# EAGLE design CARTE_PUISSANCE (EAGLE 9.5.1)
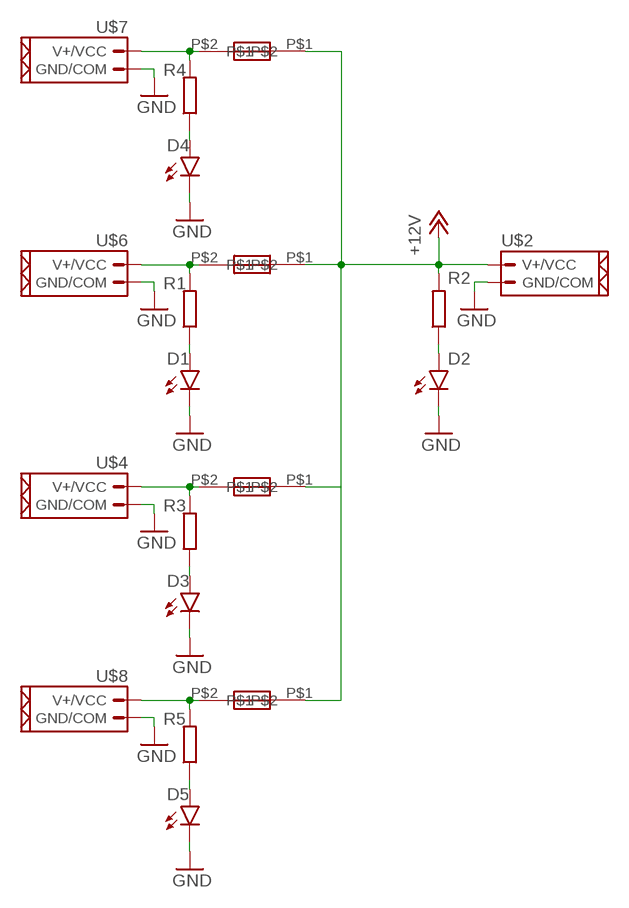
[diagram p0: schematic, sheet 1]

## Parts
D1  LED5MM  [LED_5MM]
D2  LED5MM  [LED_5MM]
D3  LED5MM  [LED_5MM]
D4  LED5MM  [LED_5MM]
D5  LED5MM  [LED_5MM]
R1  R-EU_0204/7  [0204/7]
R2  R-EU_0204/7  [0204/7]
R3  R-EU_0204/7  [0204/7]
R4  R-EU_0204/7  [0204/7]
R5  R-EU_0204/7  [0204/7]
U$1  AUTOMOTIVE_FUSE  [AUTOMOTIVE_FUSE]
U$2  CONN_02_PUIXT60  [XT60]
U$3  AUTOMOTIVE_FUSE  [AUTOMOTIVE_FUSE]
U$4  CONN_02_PUIXT60  [XT60]
U$5  AUTOMOTIVE_FUSE  [AUTOMOTIVE_FUSE]
U$6  CONN_02_PUIXT60  [XT60]
U$7  CONN_02_PUIXT60  [XT60]
U$8  CONN_02_PUIXT60  [XT60]
U$9  AUTOMOTIVE_FUSE  [AUTOMOTIVE_FUSE]

## Nets
+12V: R2.2 U$1.P$1 U$2.P$1(V+/VCC) U$3.P$1 U$5.P$1 U$9.P$1
GND: D1.K(C) D2.K(C) D3.K(C) D4.K(C) D5.K(C) U$2.P$2(GND/COM) U$4.P$2(GND/COM) U$6.P$2(GND/COM) U$7.P$2(GND/COM) U$8.P$2(GND/COM)
N$1: R1.2 U$3.P$2 U$6.P$1(V+/VCC)
N$2: D1.A R1.1
N$3: R5.2 U$8.P$1(V+/VCC) U$9.P$2
N$4: D2.A R2.1
N$5: R3.2 U$4.P$1(V+/VCC) U$5.P$2
N$6: D3.A R3.1
N$7: R4.2 U$1.P$2 U$7.P$1(V+/VCC)
N$8: D4.A R4.1
N$9: D5.A R5.1

## Library data of the parts
D1-D5 = OPENBOT:LED: LED (Generic) Standard schematic elements and footprints for 5mm, 3mm, 1206, and 0603 sized LEDs. Generic LEDs with no color specified.
R1-R5 = rcl:R-EU_: RESISTOR, European symbol; SPICEPREFIX: R
U$1 U$3 U$5 U$9 = OPENBOT:AUTOMOTIVE_FUSE
U$2 U$4 U$6-U$8 = OPENBOT:CONN_02_PUI

## Board
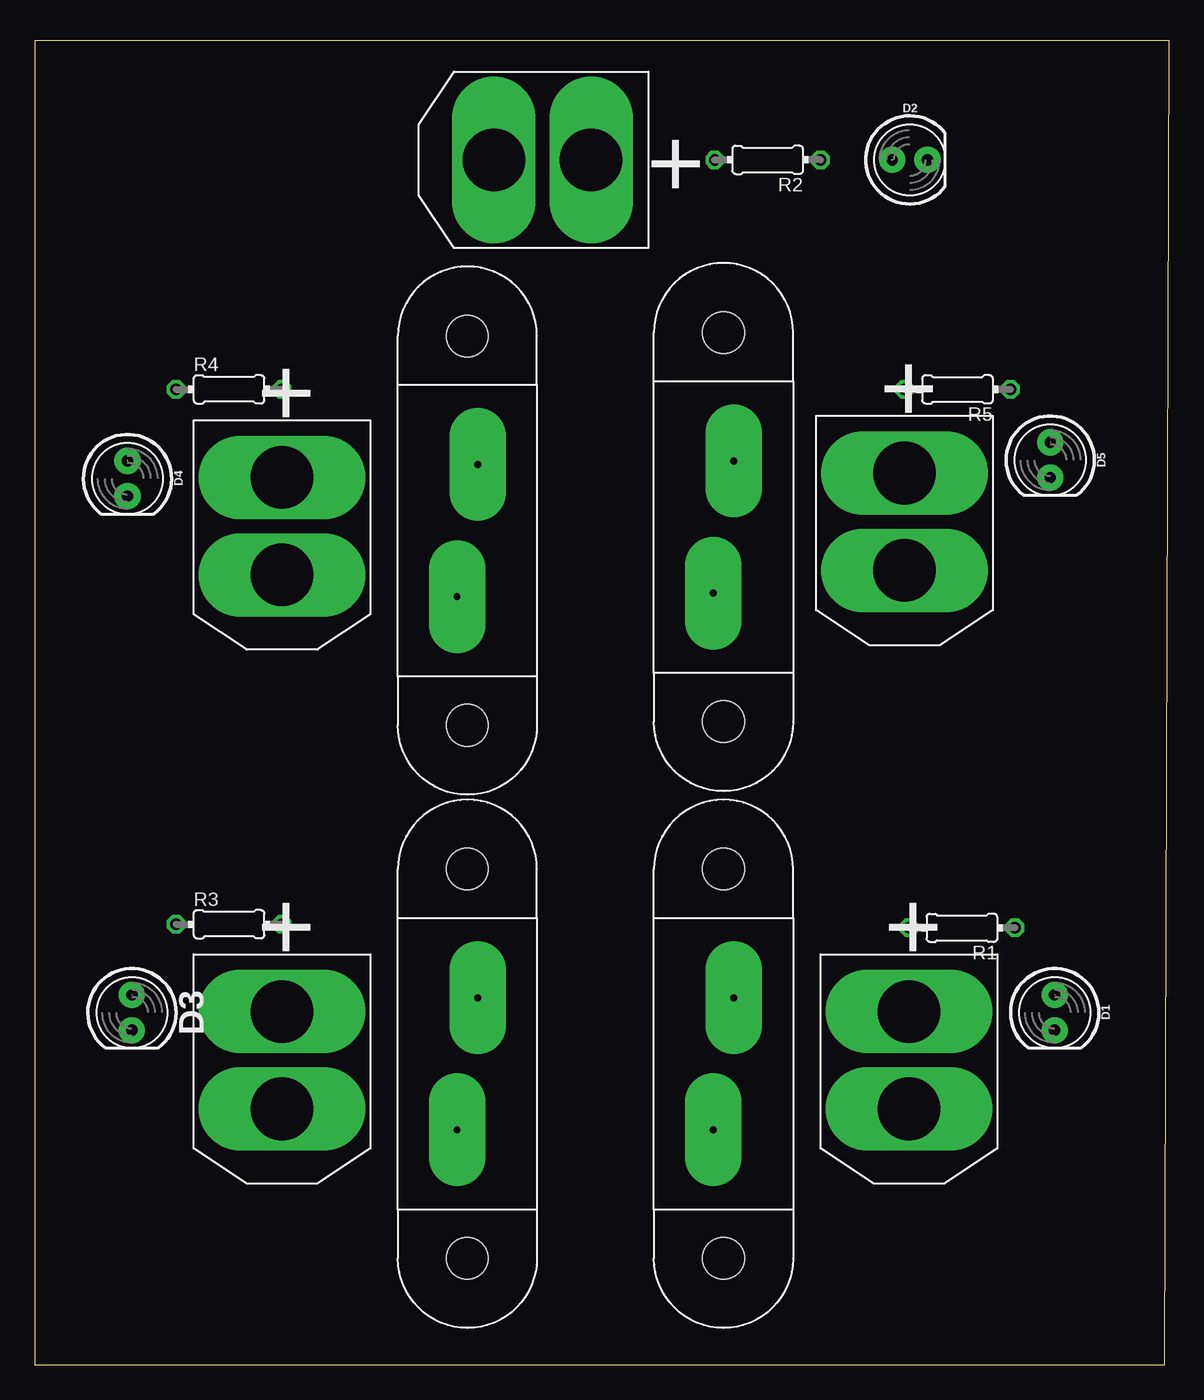
[diagram p1: board, top side]
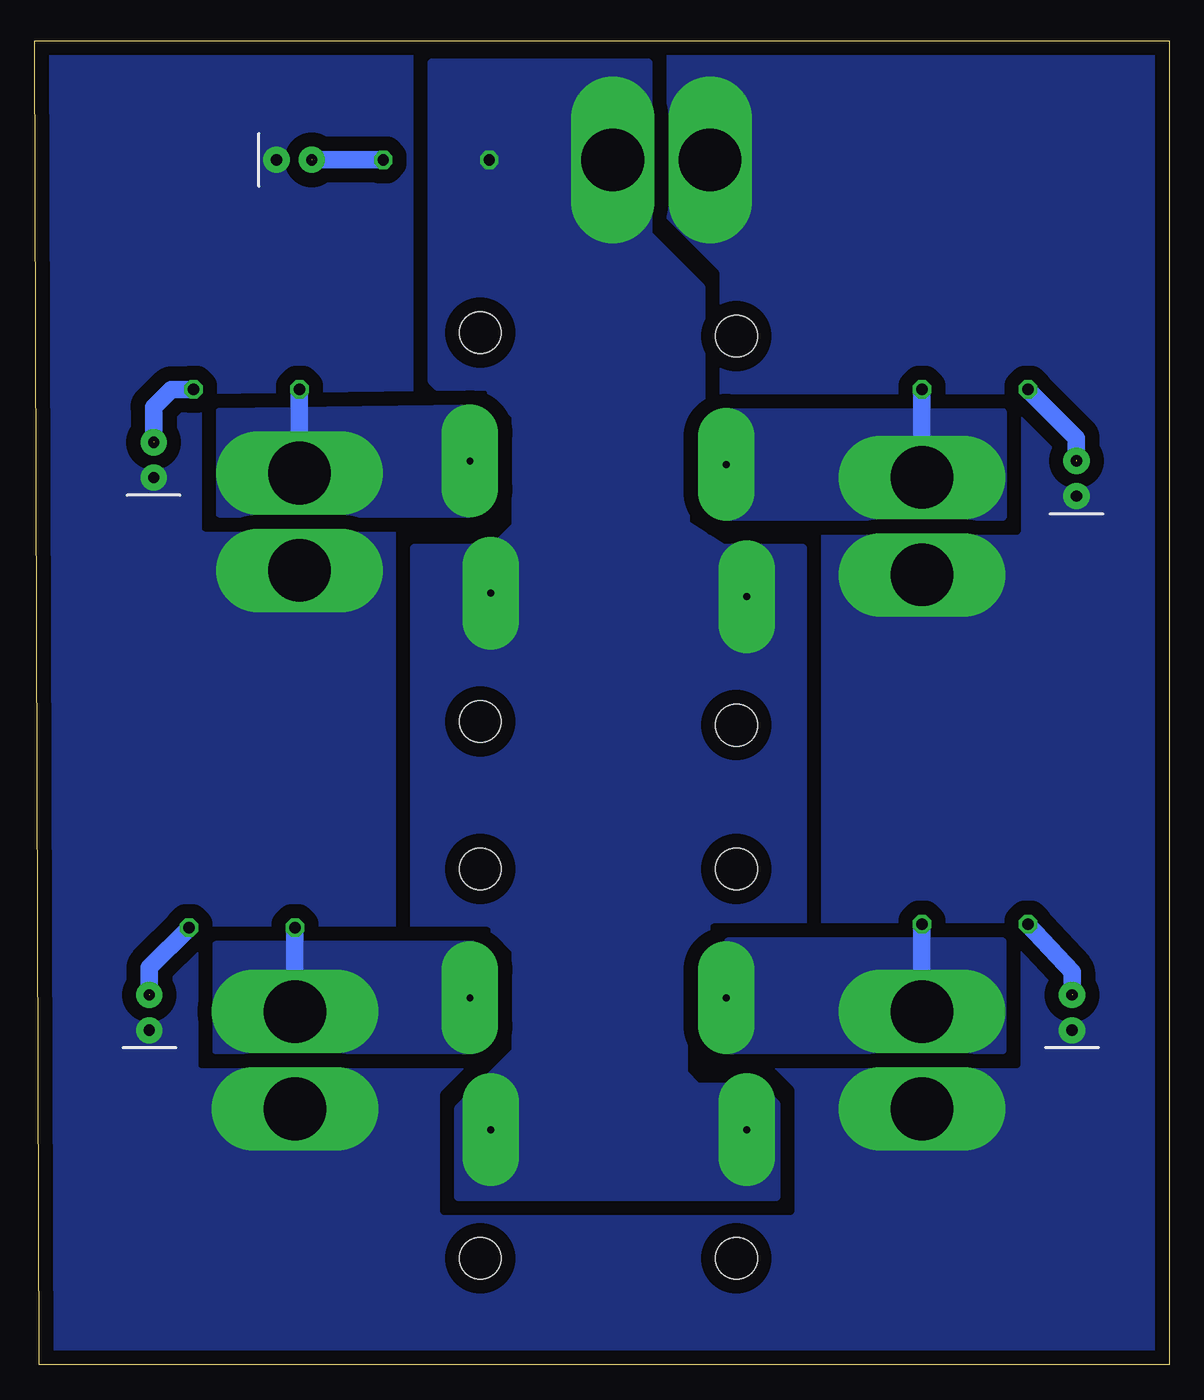
[diagram p2: board, bottom side, seen from below]

Size 81.58 x 95.24 mm. Coordinates in mm from the lower left corner, seen from the top.
Outline: 0,0 81.26,0 81.58,95.24 0,95.24 0,0
Copper layers (1*16): Top 0.035mm / dielectric 1.5mm / Bottom 0.035mm
Design rules "default *": minimum track width 6mil, minimum drill 0.35mm, track to track 40mil, track to pad 40mil, pad to pad 6mil, via to via 6mil, smd to smd 6mil, copper to edge 40mil, drill to drill 6mil, minimum pad ring 10mil, minimum via ring 8mil, stop-mask expansion 4mil, vias tented up to drill 0mil, thermal gap 10mil

### Footprints (pad centres in the part's own frame; a part is rotated, then mirrored left to right if it is on the bottom)
LED_5MM = drill 0.813 pad 1.88: A -1.27,0; K 1.27,0
0204/7 = drill 0.813 octagon: 1 -3.81,0; 2 3.81,0
AUTOMOTIVE_FUSE = drill 0.5 pad 4.064 long: P$1 -4.75,0.75; P$2 4.75,-0.75 | hole 3: -14,0; 14,0
XT60 = drill 4.5 pad 6 long: P$1 -3.5,0; P$2 3.5,0

### Placement (x,y rotation side)
D1  73.34,25.34 270 top
D2  62.93,86.68 0 top
D3  6.99,25.34 270 top
D4  6.67,63.75 270 top
D5  73.03,65.09 270 top
R1  66.67,31.43 180 top
R2  52.7,86.68 180 top
R3  13.97,31.69 0 top
R4  13.97,70.17 0 top
R5  66.36,70.17 180 top
U$1  31.11,60.01 90 top
U$2  36.51,86.68 180 top
U$3  49.53,21.65 90 top
U$4  17.78,21.91 270 top
U$5  31.11,21.65 90 top
U$6  62.87,21.91 270 top
U$7  17.78,60.33 270 top
U$8  62.55,60.64 270 top
U$9  49.53,60.26 90 top

### Tracks (layer width: path | path; a pad name or v marks a point on that pad's centre or on a via)
+12V
  pour Bottom (rank 4, no thermals): 37.47,93.66 37.47,81.28 33.66,77.47 33.66,69.53 34.92,68.26 34.77,60.48 32.07,58.74 26.35,58.74 26.35,31.11 33.66,31.11 34.92,29.84 34.92,20.95 33.97,20 29.53,20 28.26,18.73 28.26,12.06 51.12,12.06 51.12,18.41 46.99,22.54 46.99,29.84 48.26,31.11 54.29,31.11 54.29,58.74 49.21,58.74 48.9,58.42 46.99,60.33 46.99,68.26 48.58,69.85 52.07,69.85 53.02,70.8 53.02,93.66
GND
  pour Bottom (rank 6, no thermals): -0.32,95.89 81.92,95.89 81.92,-0.64 -0.64,-0.64 -0.64,95.89
N$1
  Bottom 1.27: R1.2 U$6.P$1
  pour Bottom (rank 3, no thermals): 50.04,30.23 68.58,30.23 68.58,22.61 50.04,22.61
N$2  (1 unrouted)
  Bottom 1.27: R1.1 73.34,28.57 73.34,26.66
N$3
  Bottom 1.27: R5.2 U$8.P$1
  pour Bottom (rank 3, no thermals): 50.29,68.83 68.33,68.58 68.33,61.21 50.29,61.21
N$4  (1 unrouted)
  Bottom 1.27: R2.1 61.61,86.68
N$5
  Bottom 1.27: R3.2 U$4.P$1
  pour Bottom (rank 3, no thermals): 31.75,30.48 31.75,22.61 11.94,22.61 11.94,30.48
N$6  (1 unrouted)
  Bottom 1.27: R3.1 6.99,28.26 6.99,26.66
N$7
  Bottom 1.27: R4.2 U$7.P$1
  pour Bottom (rank 3, no thermals): 32,68.58 11.94,68.58 11.94,60.96 32,60.96
N$8  (1 unrouted)
  Bottom 1.27: R4.1 6.67,66.67 6.67,65.08
N$9  (1 unrouted)
  Bottom 1.27: R5.1 71.75,70.17 73.03,68.9 73.03,66.41